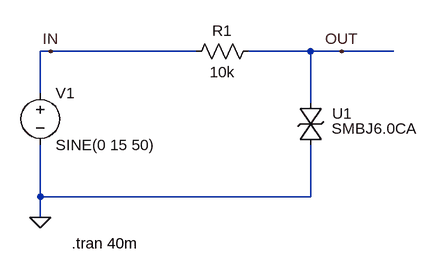
[diagram p0: schematic _SMBJxxxCA.asc]
_SMBJxxxCA.asc, the LTspice schematic file:
Version 4.1
SHEET 1 1704 680
WIRE 16 112 0 112
WIRE 240 112 16 112
WIRE 416 112 320 112
WIRE 464 112 416 112
WIRE 544 112 464 112
WIRE 0 176 0 112
WIRE 416 192 416 112
WIRE 0 336 0 256
WIRE 416 336 416 256
WIRE 416 336 0 336
WIRE 0 368 0 336
FLAG 0 368 0
FLAG 16 112 IN
FLAG 464 112 OUT
SYMBOL voltage 0 160 R0
WINDOW 123 0 0 Left 0
WINDOW 39 0 0 Left 0
SYMATTR InstName V1
SYMATTR Value SINE(0 15 50)
SYMBOL res 336 96 R90
WINDOW 0 0 56 VBottom 2
WINDOW 3 32 56 VTop 2
SYMATTR InstName R1
SYMATTR Value 10k
SYMBOL MyLib\\Diode_TVS\\_SMBJxxxCA 400 192 R0
SYMATTR InstName U1
TEXT 48 408 Left 2 !.tran 40m

The netlist it stands for:
* _SMBJxxxCA.asc
V1 IN 0 SINE(0 15 50)
R1 OUT IN 10k
X§U1 OUT 0 SMBJ6.0CA  ; pins + -
.tran 40m
.lib MyLib/Diode_TVS/_SMBJxxxCA.lib
.backanno
.end